# EAGLE schematic Servo_Schematic (EAGLE 9.7.0)
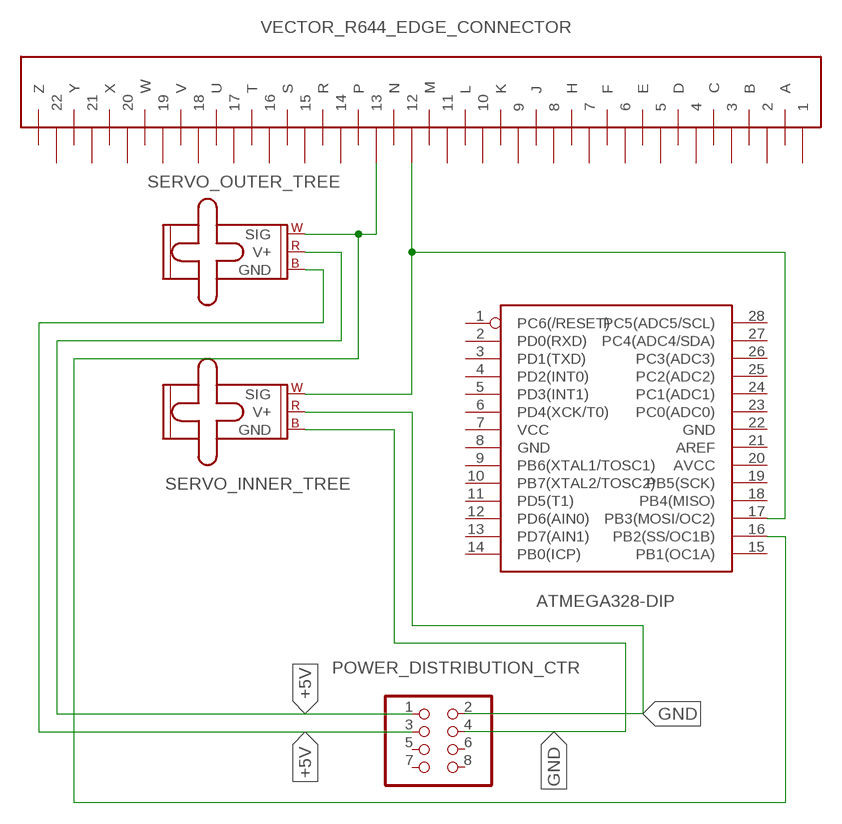
[diagram p0: schematic, sheet 1]

## Parts
POWER_DISTRIBUTION_CTR  PINHD-2X4  [2X04]
SERVO_INNER_TREE  SERVO  [1X03]
SERVO_OUTER_TREE  SERVO  [1X03]
U$7  ATMEGA328-DIP  [DIP28]
U$8  VECTOR_R644_EDGE_CONNECTOR  [VECTOR44]

## Nets
+5V: POWER_DISTRIBUTION_CTR.1 POWER_DISTRIBUTION_CTR.3 SERVO_OUTER_TREE.2(V+) SERVO_OUTER_TREE.3(GND)
GND: POWER_DISTRIBUTION_CTR.2 POWER_DISTRIBUTION_CTR.4 SERVO_INNER_TREE.2(V+) SERVO_INNER_TREE.3(GND)
N$15: SERVO_INNER_TREE.1(SIG) U$7.17(PB3(MOSI/OC2)) U$8.P$12
N$16: SERVO_OUTER_TREE.1(SIG) U$7.16(PB2(SS/OC1B)) U$8.P$13
Unconnected: POWER_DISTRIBUTION_CTR.5 POWER_DISTRIBUTION_CTR.6 POWER_DISTRIBUTION_CTR.7 POWER_DISTRIBUTION_CTR.8 U$7.1(PC6(/RESET)) U$7.2(PD0(RXD)) U$7.3(PD1(TXD)) U$7.4(PD2(INT0)) U$7.5(PD3(INT1)) U$7.6(PD4(XCK/T0)) U$7.7(VCC) U$7.8(GND) U$7.9(PB6(XTAL1/TOSC1)) U$7.10(PB7(XTAL2/TOSC2)) U$7.11(PD5(T1)) U$7.12(PD6(AIN0)) U$7.13(PD7(AIN1)) U$7.14(PB0(ICP)) U$7.15(PB1(OC1A)) U$7.18(PB4(MISO)) U$7.19(PB5(SCK)) U$7.20(AVCC) U$7.21(AREF) U$7.22(GND) U$7.23(PC0(ADC0)) U$7.24(PC1(ADC1)) U$7.25(PC2(ADC2)) U$7.26(PC3(ADC3)) U$7.27(PC4(ADC4/SDA)) U$7.28(PC5(ADC5/SCL)) U$8.P$1 U$8.P$2 U$8.P$3 U$8.P$4 U$8.P$5 U$8.P$6 U$8.P$7 U$8.P$8 U$8.P$9 U$8.P$10 U$8.P$11 U$8.P$14 U$8.P$15 U$8.P$16 U$8.P$17 U$8.P$18 U$8.P$19 U$8.P$20 U$8.P$21 U$8.P$22 U$8.P$A(A) U$8.P$B(B) U$8.P$C(C) U$8.P$D(D) U$8.P$E(E) U$8.P$F(F) U$8.P$H(H) U$8.P$J(J) U$8.P$K(K) U$8.P$L(L) U$8.P$M(M) U$8.P$N(N) U$8.P$P(P) U$8.P$R(R) U$8.P$S(S) U$8.P$T(T) U$8.P$U(U) U$8.P$V(V) U$8.P$W(W) U$8.P$X(X) U$8.P$Y(Y) U$8.P$Z(Z)

## Library data of the parts
POWER_DISTRIBUTION_CTR = adafruit:PINHD-2X4: PIN HEADER
SERVO_INNER_TREE SERVO_OUTER_TREE = SparkFun-Electromechanical:SERVO: Servo Motor 3-pin connector for a standard servo motor (voltage supply, ground, and control signal.) SparkFun Products Servo - Generic (Sub-Micro Size) <https://www.sparkfun.com/products/9065> (ROB-09065) Servo - Generic High Torque Continuous Rotation (Standard Size) <https://www.sparkfun.com/products/9347> (ROB-09347) Servo - Generic High Torque (Standard Size) <https://www.sparkfun.com/products/11965> (ROB-11965)
U$7 = JDP_created_v7:ATMEGA328-DIP
U$8 = JDP_created_v7:VECTOR_R644_EDGE_CONNECTOR